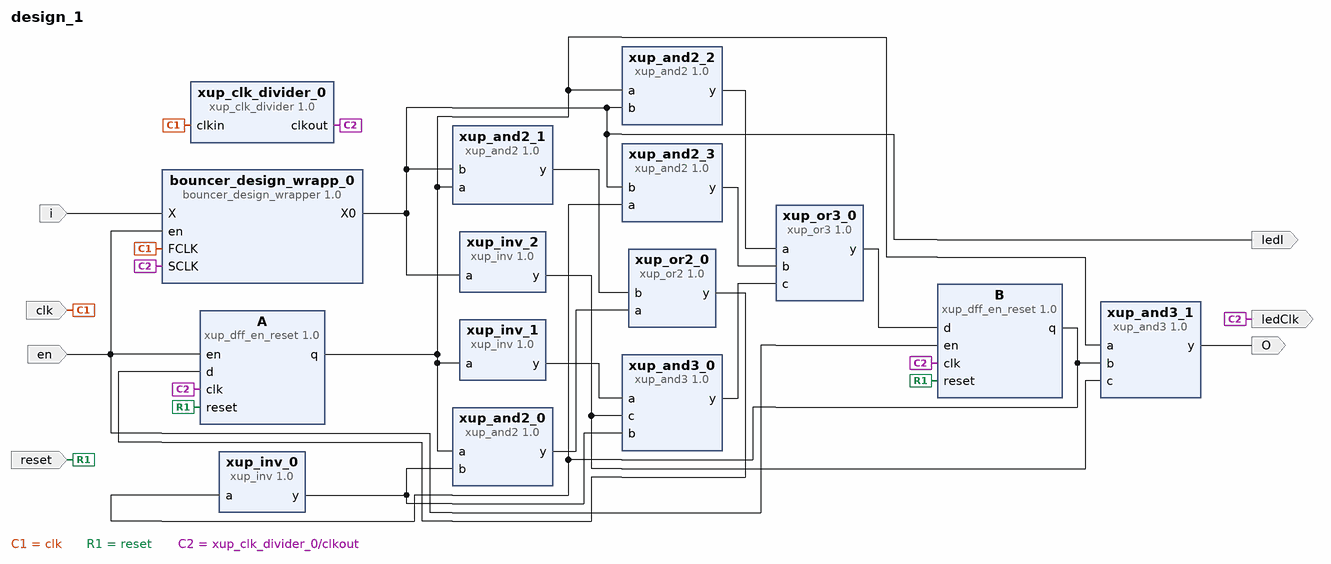
[diagram p0: block diagram of the top level]
# Vivado block design design_1, xc7a35tcpg236-1, Vivado 2023.1
create_bd_design design_1

create_bd_port -dir I clk
create_bd_port -dir I reset
create_bd_port -dir I en
create_bd_port -dir I i
create_bd_port -dir O O
create_bd_port -dir O ledClk
create_bd_port -dir O ledI

create_bd_cell -type ip -vlnv xilinx.com:XUP:xup_clk_divider:1.0 xup_clk_divider_0
set_property -dict {CONFIG.SIZE 200000000} [get_bd_cells xup_clk_divider_0]
create_bd_cell -type ip -vlnv xilinx.com:XUP:xup_dff_en_reset:1.0 A
create_bd_cell -type ip -vlnv xilinx.com:XUP:xup_dff_en_reset:1.0 B
create_bd_cell -type ip -vlnv xilinx.com:XUP:xup_inv:1.0 xup_inv_0
create_bd_cell -type ip -vlnv xilinx.com:XUP:xup_and2:1.0 xup_and2_0
create_bd_cell -type ip -vlnv xilinx.com:XUP:xup_and2:1.0 xup_and2_1
create_bd_cell -type ip -vlnv xilinx.com:XUP:xup_and2:1.0 xup_and2_2
create_bd_cell -type ip -vlnv xilinx.com:XUP:xup_and2:1.0 xup_and2_3
create_bd_cell -type ip -vlnv xilinx.com:XUP:xup_and3:1.0 xup_and3_0
create_bd_cell -type ip -vlnv xilinx.com:XUP:xup_inv:1.0 xup_inv_1
create_bd_cell -type ip -vlnv xilinx.com:XUP:xup_inv:1.0 xup_inv_2
create_bd_cell -type ip -vlnv xilinx.com:XUP:xup_or2:1.0 xup_or2_0
create_bd_cell -type ip -vlnv xilinx.com:XUP:xup_or3:1.0 xup_or3_0
create_bd_cell -type ip -vlnv xilinx.com:XUP:xup_and3:1.0 xup_and3_1
create_bd_cell -type ip -vlnv xilinx.com:user:bouncer_design_wrapper:1.0 bouncer_design_wrapp_0

# ---- connections ----

connect_bd_net [get_bd_pins A/q] \
  [get_bd_pins xup_and2_0/a] [get_bd_pins xup_and2_1/a] [get_bd_pins xup_and2_2/a] [get_bd_pins xup_inv_1/a] \
  [get_bd_pins xup_and3_1/a]
connect_bd_net [get_bd_pins B/q] [get_bd_pins xup_inv_0/a] [get_bd_pins xup_and2_3/a] [get_bd_pins xup_and3_1/b]
connect_bd_net [get_bd_pins bouncer_design_wrapp_0/X0] \
  [get_bd_pins xup_and2_1/b] [get_bd_pins xup_and2_2/b] [get_bd_pins xup_and2_3/b] [get_bd_pins xup_inv_2/a] \
  [get_bd_ports ledI]
connect_bd_net [get_bd_ports clk] [get_bd_pins xup_clk_divider_0/clkin] [get_bd_pins bouncer_design_wrapp_0/FCLK]
connect_bd_net [get_bd_ports en] [get_bd_pins A/en] [get_bd_pins B/en] [get_bd_pins bouncer_design_wrapp_0/en]
connect_bd_net [get_bd_ports i] [get_bd_pins bouncer_design_wrapp_0/X]
connect_bd_net [get_bd_ports reset] [get_bd_pins A/reset] [get_bd_pins B/reset]
connect_bd_net [get_bd_pins xup_and2_0/y] [get_bd_pins xup_or2_0/a]
connect_bd_net [get_bd_pins xup_and2_1/y] [get_bd_pins xup_or2_0/b]
connect_bd_net [get_bd_pins xup_and2_2/y] [get_bd_pins xup_or3_0/a]
connect_bd_net [get_bd_pins xup_and2_3/y] [get_bd_pins xup_or3_0/b]
connect_bd_net [get_bd_pins xup_and3_0/y] [get_bd_pins xup_or3_0/c]
connect_bd_net [get_bd_pins xup_and3_1/y] [get_bd_ports O]
connect_bd_net [get_bd_pins xup_clk_divider_0/clkout] \
  [get_bd_pins A/clk] [get_bd_pins B/clk] [get_bd_ports ledClk] [get_bd_pins bouncer_design_wrapp_0/SCLK]
connect_bd_net [get_bd_pins xup_inv_0/y] [get_bd_pins xup_and2_0/b] [get_bd_pins xup_and3_0/b]
connect_bd_net [get_bd_pins xup_inv_1/y] [get_bd_pins xup_and3_0/a]
connect_bd_net [get_bd_pins xup_inv_2/y] [get_bd_pins xup_and3_0/c] [get_bd_pins xup_and3_1/c]
connect_bd_net [get_bd_pins xup_or2_0/y] [get_bd_pins A/d]
connect_bd_net [get_bd_pins xup_or3_0/y] [get_bd_pins B/d]

validate_bd_design
save_bd_design
